# EAGLE design breakout_pmg001 (EAGLE 9.6.2)
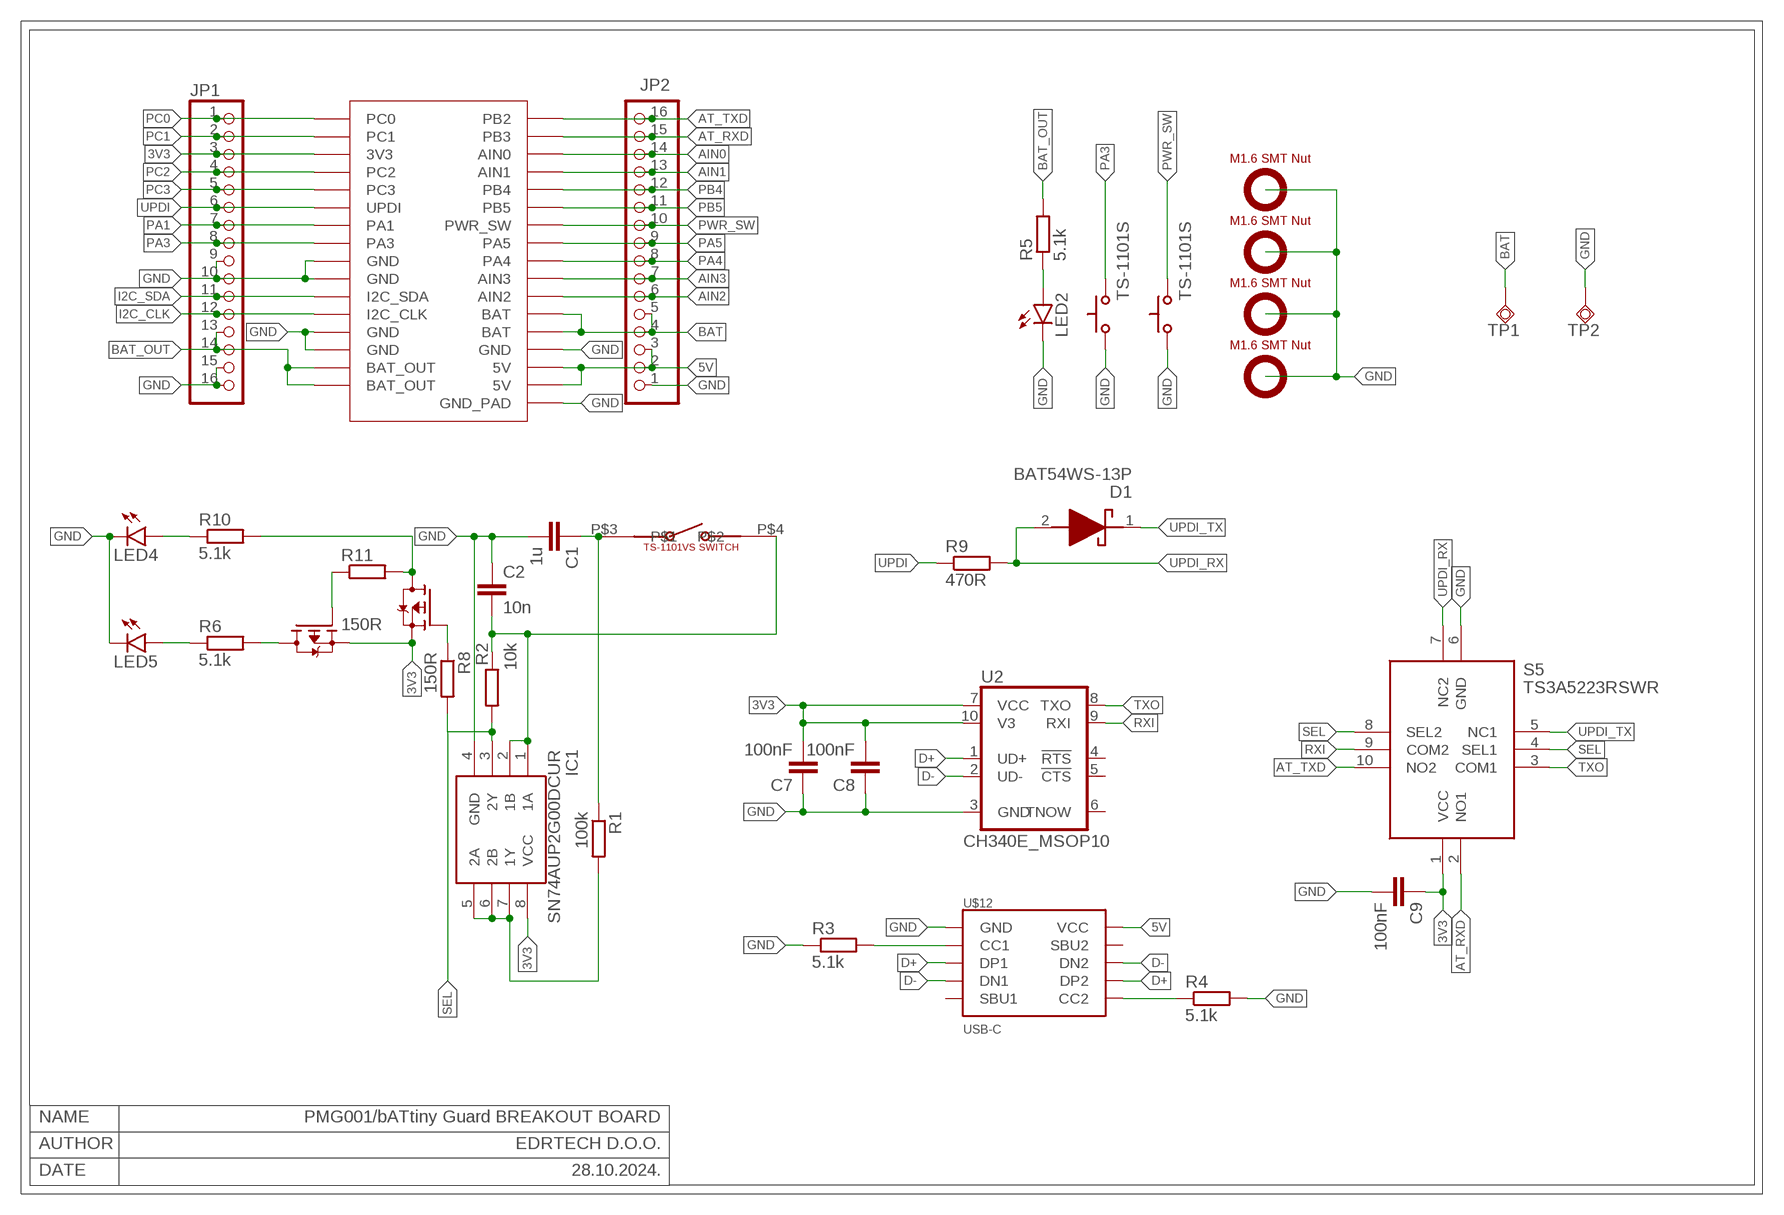
[diagram p0: schematic, sheet 1]

## Parts
C1  1u  C-EUC0402  [C0402]
C2  10n  C-EUC0402  [C0402]
C7  100nF  C-EUC0402  [C0402]
C8  100nF  C-EUC0402  [C0402]
C9  100nF  C-EUC0402  [C0402]
D1  BAT54WS-13P  [SOD2512X115N]
IC1  SN74AUP2G00DCUR  [SOP50P310X90-8N]
JP1  PINHD-1X16  [1X16]
JP2  PINHD-1X16  [1X16]
LED2  LEDCHIP-LED0603  [CHIP-LED0603]
LED4  LEDCHIP-LED0603  [CHIP-LED0603]
LED5  LEDCHIP-LED0603  [CHIP-LED0603]
Q1  NTK3139PT1G  [SOTFL40P120X55-3N]
Q2  NTK3139PT1G  [SOTFL40P120X55-3N]
R1  100k  R-EU_R0402  [R0402]
R2  10k  R-EU_R0402  [R0402]
R3  5.1k  R-EU_R0402  [R0402]
R4  5.1k  R-EU_R0402  [R0402]
R5  5.1k  R-EU_R0402  [R0402]
R6  5.1k  R-EU_R0402  [R0402]
R8  150R  R-EU_R0402  [R0402]
R9  470R  R-EU_R0402  [R0402]
R10  5.1k  R-EU_R0402  [R0402]
R11  150R  R-EU_R0402  [R0402]
S5  TS3A5223RSWR  [RSW(RPUQFNN10)]
TP1  TPSQTP19SQ  [TP19SQ]
TP2  TPSQTP19SQ  [TP19SQ]
U2  CH340E_MSOP10  [MSOP10]
U$1  TS-1101S  [TS-1101S]
U$2  TS-1101VS-C-A-A  [TS-1101VS-C-A-A]
U$4  TS-1101S  [TS-1101S]
U$7  PMG001  [PMG001]
U$8  SMTSO16  [SMTSO16]
U$9  SMTSO16  [SMTSO16]
U$10  SMTSO16  [SMTSO16]
U$11  SMTSO16  [SMTSO16]
U$12  USB-C  [USB-C]

## Nets
3V3: C7.2 C8.2 C9.1 IC1.8(VCC) JP1.3 Q1.2(S) Q2.2(S) S5.1(VCC) U2.7(VCC) U2.10(V3) U$7.P$3(3V3)
5V: JP2.2 JP2.3 U$7.P$17(5V) U$7.P$18(5V) U$12.VCC@1(VCC) U$12.VCC@2(VCC)
AIN0: JP2.14 U$7.P$30(AIN0)
AIN1: JP2.13 U$7.P$29(AIN1)
AIN2: JP2.6 U$7.P$22(AIN2)
AIN3: JP2.7 U$7.P$23(AIN3)
AT_RXD: JP2.15 S5.2(NO1) U$7.P$31(PB3)
AT_TXD: JP2.16 S5.10(NO2) U$7.P$32(PB2)
BAT: JP2.4 JP2.5 TP1.TP U$7.P$20(BAT) U$7.P$21(BAT)
BAT_OUT: JP1.13 JP1.14 R5.2 U$7.P$15(BAT_OUT) U$7.P$16(BAT_OUT)
D+: U2.1(UD+) U$12.DP1 U$12.DP2
D-: U2.2(UD-) U$12.DN1 U$12.DN2
GND: C1.2 C2.1 C7.1 C8.1 C9.2 IC1.4(GND) JP1.9 JP1.10 JP1.15 JP1.16 JP2.1 LED2.C LED4.C LED5.C R3.1 R4.2 S5.6(GND) TP2.TP U2.3(GND) U$1.P$1 U$4.P$1 U$7.P$9(GND) U$7.P$10(GND) U$7.P$13(GND) U$7.P$14(GND) U$7.P$19(GND) U$7.P$33(GND_PAD) U$8.P$1 U$9.P$1 U$10.P$1 U$11.P$1 U$12.GND@1(GND) U$12.GND@2(GND) U$12.P$1(GND) U$12.P$2(GND) U$12.P$3(GND) U$12.P$4(GND)
I2C_CLK: JP1.12 U$7.P$12(I2C_CLK)
I2C_SDA: JP1.11 U$7.P$11(I2C_SDA)
N$1: C2.2 IC1.1(1A) IC1.2(1B) R2.1 U$2.P$4
N$2: R3.2 U$12.CC1
N$3: LED2.A R5.1
N$4: LED5.A R6.1
N$5: Q1.1(G) R8.1
N$6: R4.1 U$12.CC2
N$7: IC1.5(2A) IC1.6(2B) IC1.7(1Y) R1.2
N$8: Q1.3(D) R10.2 R11.2
N$9: Q2.3(D) R6.2
N$10: LED4.A R10.1
N$11: C1.1 R1.1 U$2.P$3
N$12: Q2.1(G) R11.1
PA1: JP1.7 U$7.P$7(PA1)
PA3: JP1.8 U$1.P$2 U$7.P$8(PA3)
PA4: JP2.8 U$7.P$24(PA4)
PA5: JP2.9 U$7.P$25(PA5)
PB4: JP2.12 U$7.P$28(PB4)
PB5: JP2.11 U$7.P$27(PB5)
PC0: JP1.1 U$7.P$1(PC0)
PC1: JP1.2 U$7.P$2(PC1)
PC2: JP1.4 U$7.P$4(PC2)
PC3: JP1.5 U$7.P$5(PC3)
PWR_SW: JP2.10 U$4.P$2 U$7.P$26(PWR_SW)
RXI: S5.9(COM2) U2.9(RXI)
SEL: IC1.3(2Y) R2.2 R8.2 S5.4(SEL1) S5.8(SEL2)
TXO: S5.3(COM1) U2.8(TXO)
UPDI: JP1.6 R9.1 U$7.P$6(UPDI)
UPDI_RX: D1.2(A) R9.2 S5.7(NC2)
UPDI_TX: D1.1(K) S5.5(NC1)
Unconnected: U2.4(!RTS) U2.5(!CTS) U2.6(TNOW) U$12.SBU1 U$12.SBU2

## Notes on the sheet
- NAME | PMG001/bATtiny Guard BREAKOUT BOARD
- AUTHOR | EDRTECH D.O.O.
- DATE | 28.10.2024.

## Library data of the parts
C1 C2 C7-C9 = rcl:C-EU: CAPACITOR, European symbol; SPICEPREFIX: C
D1 = BAT54WS-13P:BAT54WS-13P: Diode 30 V 200mA Surface Mount SOD-323 Source: Datasheet <https://www.mccsemi.com/pdf/Products/BAT54WS(SOD-323).pdf>; DESCRIPTION: Diode 30 V 200mA Surface Mount SOD-323; HEIGHT: 1.15mm; MANUFACTURER_NAME: MCC; MANUFACTURER_PART_NUMBER: BAT54WS-13P
IC1 = SN74AUP2G00DCUR:SN74AUP2G00DCUR: LOW-POWER DUAL 2-INPUT POSITIVE-NAND GATE Source: Datasheet <http://www.ti.com/lit/gpn/sn74aup2g00>; ARROW_PART_NUMBER: SN74AUP2G00DCUR; ARROW_PRICE-STOCK: https://www.arrow.com/en/products/sn74aup2g00dcur/texas-instruments?region=nac; DESCRIPTION: LOW-POWER DUAL 2-INPUT POSITIVE-NAND GATE; HEIGHT: 0.9mm; MANUFACTURER_NAME: Texas Instruments; MANUFACTURER_PART_NUMBER: SN74AUP2G00DCUR; MOUSER_PART_NUMBER: 595-SN74AUP2G00DCUR; MOUSER_PRICE-STOCK: https://www.mouser.co.uk/ProductDetail/Texas-Instruments/SN74AUP2G00DCUR?qs=%2Fqzd9s%252BcLd4Cllum%2F%252Bgttg%3D%3D
JP1 JP2 = edrtech_lib:PINHD-1X16: PIN HEADER
LED2 LED4 LED5 = led:LED: LED OSRAM: - CHIPLED LG R971, LG N971, LY N971, LG Q971, LY Q971, LO R971, LY R971 LH N974, LH R974 LS Q976, LO Q976, LY Q976 LO Q996 - Hyper CHIPLED LW Q18S LB Q993, LB Q99A, LB R99A - SideLED LS A670, LO A670, LY A670, LG A670, LP A670 LB A673, LV A673, LT A673, LW A673 LH A674 LY A675 LS A676, LA A676, LO A676, LY A676, LW A676 LS A679, LY A679, LG A679 - Hyper Micro SIDELED® LS Y876, LA Y876, LO Y876, LY Y876 LT Y87S - SmartLED LW L88C, LW L88S LB L89C, LB L89S, LG L890 LS L89K, LO L89K, LY L89K LS L896, LA L896, LO L896, LY L896 - TOPLED LS T670, LO T670, LY T670, LG T670, LP T670 LSG T670, LSP T670, LSY T670, LOP T670, LYG T670 LG T671, LOG T671, LSG T671 LB T673, LV T673, LT T673, LW T673 LH T674 LS T676, LA T676, LO T676, LY T676, LB T676, LH T676, LSB T676, LW T676 LB T67C, LV T67C, LT T67C, LS T67K, LO T67K, LY T67K, LW E67C LS E67B, LA E67B, LO E67B, LY E67B, LB E67C, LV E67C, LT E67C LW T67C LS T679, LY T679, LG T679 LS T770, LO T770, LY T770, LG T770, LP T770 LB T773, LV T773, LT T773, LW T773 LH T774 LS E675, LA E675, LY E675, LS T675 LS T776, LA T776, LO T776, LY T776, LB T776 LHGB T686 LT T68C, LB T68C - Hyper Mini TOPLED® LB M676 - Mini TOPLED Santana® LG M470 LS M47K, LO M47K, LY M47K Source: http://www.osram.convergy.de LUXEON: - LUMILED® LXK2-PW12-R00, LXK2-PW12-S00, LXK2-PW14-U00, LXK2-PW14-V00 LXK2-PM12-R00, LXK2-PM12-S00, LXK2-PM14-U00 LXK2-PE12-Q00, LXK2-PE12-R00, LXK2-PE12-S00, LXK2-PE14-T00, LXK2-PE14-U00 LXK2-PB12-K00, LXK2-PB12-L00, LXK2-PB12-M00, LXK2-PB14-N00, LXK2-PB14-P00, LXK2-PB14-Q00 LXK2-PR12-L00, LXK2-PR12-M00, LXK2-PR14-Q00, LXK2-PR14-R00 LXK2-PD12-Q00, LXK2-PD12-R00, LXK2-PD12-S00 LXK2-PH12-R00, LXK2-PH12-S00 LXK2-PL12-P00, LXK2-PL12-Q00, LXK2-PL12-R00 Source: www.luxeon.com KINGBRIGHT: KA-3528ASYC Source: www.kingbright.com
Q1 Q2 = edrtech_lib:NTK3139PT1G: ON Semiconductor NTK3139PT1G P-channel MOSFET Transistor, 0.87 A, -20 V, 3-Pin SOT-723 Source: Datasheet <http://www.onsemi.com/pub_link/Collateral/NTK3139P-D.PDF>; ARROW_PART_NUMBER: NTK3139PT1G; ARROW_PRICE-STOCK: https://www.arrow.com/en/products/ntk3139pt1g/on-semiconductor; DESCRIPTION: ON Semiconductor NTK3139PT1G P-channel MOSFET Transistor, 0.87 A, -20 V, 3-Pin SOT-723; HEIGHT: 0.55mm; MANUFACTURER_NAME: onsemi; MANUFACTURER_PART_NUMBER: NTK3139PT1G; MOUSER_PART_NUMBER: 863-NTK3139PT1G; MOUSER_PRICE-STOCK: https://www.mouser.co.uk/ProductDetail/onsemi/NTK3139PT1G?qs=g97OBWmz8%2FUOleSHsosIkQ%3D%3D
R1-R6 R8-R11 = rcl:R-EU_: RESISTOR, European symbol; SPICEPREFIX: R
S5 = TS3A5223RSWR:TS3A5223RSWR: 0.5 Dual SPDT Bidirectional Analog Switch Source: Datasheet <http://www.ti.com/lit/gpn/ts3a5223>; ARROW_PART_NUMBER: TS3A5223RSWR; ARROW_PRICE-STOCK: https://www.arrow.com/en/products/ts3a5223rswr/texas-instruments?region=nac; DESCRIPTION: 0.5 Dual SPDT Bidirectional Analog Switch; HEIGHT: mm; MANUFACTURER_NAME: Texas Instruments; MANUFACTURER_PART_NUMBER: TS3A5223RSWR; MOUSER_PART_NUMBER: 595-TS3A5223RSWR; MOUSER_PRICE-STOCK: https://www.mouser.co.uk/ProductDetail/Texas-Instruments/TS3A5223RSWR?qs=nEyf2%252Bd9RBmZJQRiNjZi8g%3D%3D
TP1 TP2 = testpad:TPSQ: Test pad
U2 = CH340E:CH340E: Check availability <https://pricing.snapeda.com/parts/CH340E/WCH/view-part?ref=eda>; AVAILABILITY: Not in stock; CHECK_PRICES: https://www.snapeda.com/parts/CH340E/WCH/view-part/?ref=eda; DESCRIPTION: USB to serial chip CH340; MF: WCH; MP: CH340E; PACKAGE: Package; PRICE: None; SNAPEDA_LINK: https://www.snapeda.com/parts/CH340E/WCH/view-part/?ref=snap
U$1 U$4 = edrtech_lib:TS-1101S
U$2 = circuitmess_device_library:TS-1101VS-C-A-A
U$7 = edrtech_lib:PMG001
U$8-U$11 = edrtech_lib:SMTSO16
U$12 = edrtech_lib:USB-C

## Board
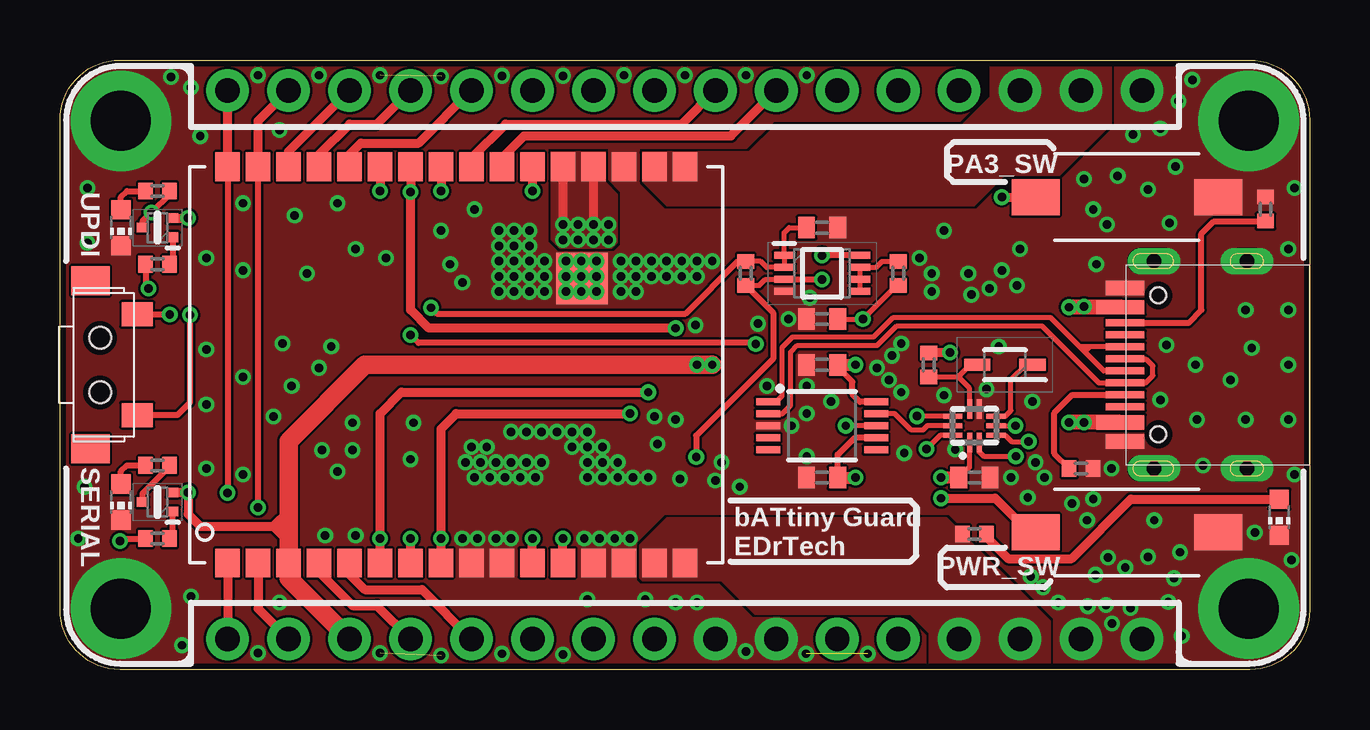
[diagram p1: board, top side]
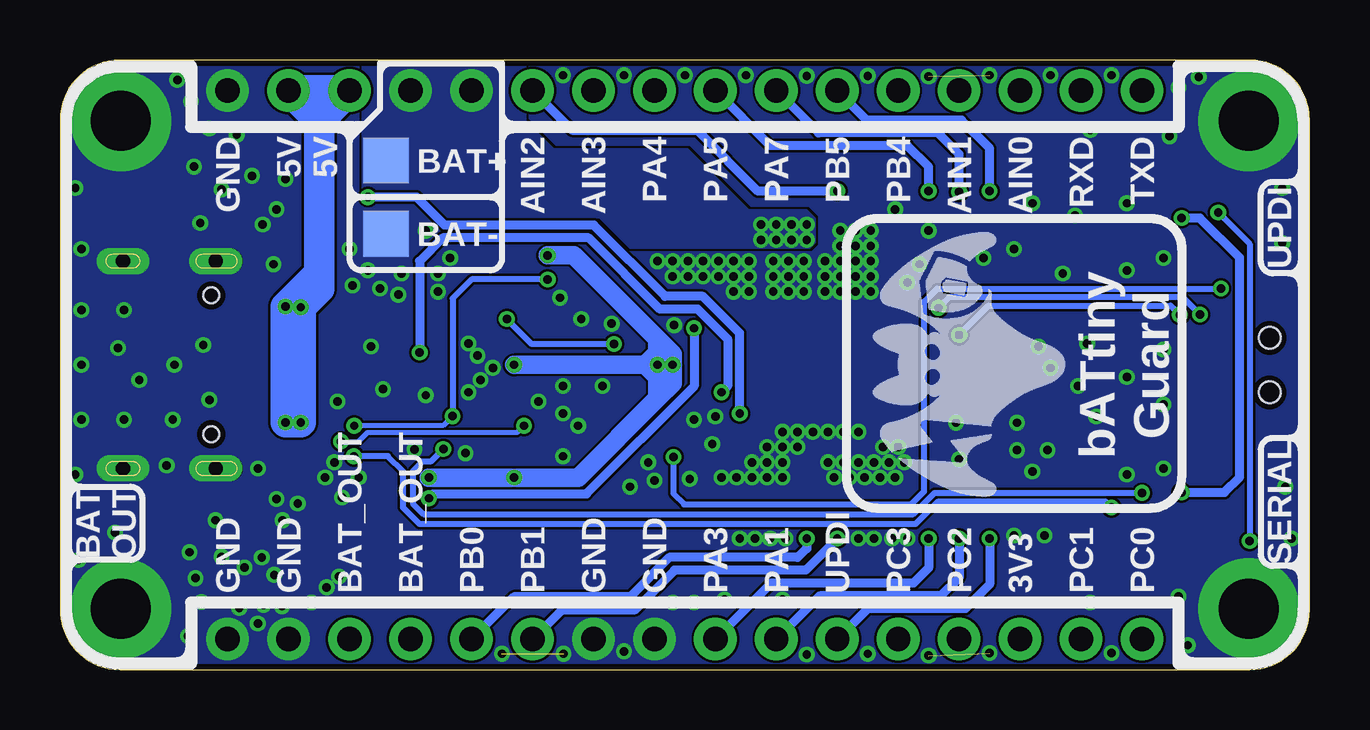
[diagram p2: board, bottom side, seen from below]

Size 52.07 x 25.4 mm. Coordinates in mm from the lower left corner, seen from the top.
Outline: 52.07,22.9 52.07,2.5 arc-90 49.57,0 2.5,0 arc-90 0,2.5 0,22.9 arc-90 2.5,25.4 49.57,25.4 arc-90 52.07,22.9
Copper layers (1*16): Top 0.035mm / dielectric 1.5mm / Bottom 0.035mm
Design rules "dirt_cheap_dirty_boards.v1.1 *": minimum track width 6mil, minimum drill 12mil, track to track 4mil, track to pad 6mil, pad to pad 6mil, via to via 6mil, smd to smd 0mil, copper to edge 10mil, drill to drill 10mil, minimum pad ring 10mil, minimum via ring 6mil, stop-mask expansion 2mil, vias tented up to drill 25mil, thermal gap 10mil

### Footprints (pad centres in the part's own frame; a part is rotated, then mirrored left to right if it is on the bottom)
C0402 = smd 0.7 x 0.9: 1 -0.65,0; 2 0.65,0
SOD2512X115N = smd 1.1 x 0.5: 1 -1.15,0; 2 1.15,0
SOP50P310X90-8N = smd 0.85 x 0.3: 1 -1.575,0.75; 2 -1.575,0.25; 3 -1.575,-0.25; 4 -1.575,-0.75; 5 1.575,-0.75; 6 1.575,-0.25; 7 1.575,0.25; 8 1.575,0.75
1X16 = drill 1.016 pad 1.778: 1 -19.05,0; 2 -16.51,0; 3 -13.97,0; 4 -11.43,0; 5 -8.89,0; 6 -6.35,0; 7 -3.81,0; 8 -1.27,0; 9 1.27,0; 10 3.81,0; 11 6.35,0; 12 8.89,0; 13 11.43,0; 14 13.97,0; 15 16.51,0; 16 19.05,0
CHIP-LED0603 = smd 0.8 x 0.8: A 0,-0.75; C 0,0.75
SOTFL40P120X55-3N = smd 0.465 x 0.4: 1 -0.632,0.4; 2 -0.632,-0.4; 3 0.632,0
R0402 = smd 0.6 x 0.7: 1 -0.5,0; 2 0.5,0
RSW(RPUQFNN10) = smd 0.2 x 0.8: 1 -0.2,-0.7; 2 0.2,-0.7; 6 0.2,0.7; 7 -0.2,0.7 | smd 0.8 x 0.2: 3 0.9,-0.4; 4 0.9,0; 5 0.9,0.4; 8 -0.9,0.4; 9 -0.9,0; 10 -0.9,-0.4
TP19SQ = smd 1.9 x 1.9: TP 0,0
MSOP10 = smd 1 x 0.3: 1 -2.25,1; 2 -2.25,0.5; 3 -2.25,0; 4 -2.25,-0.5; 5 -2.25,-1; 6 2.25,-1; 7 2.25,-0.5; 8 2.25,0; 9 2.25,0.5; 10 2.25,1
TS-1101S = smd 2 x 1.5: P$1 -3.8,0; P$2 3.8,0
TS-1101VS-C-A-A = smd 1.2 x 1.6: GND -3.5,0; GND@1 3.5,0 | smd 1 x 1.3: P$3 -2.1,-1.95; P$4 2.1,-1.95 | hole 0.9: -1.15,-0.4; 1.12,-0.4
PMG001 = smd 1.194 x 1.016: P$1 -8.255,9.525; P$2 -8.255,8.255; P$3 -8.255,6.985; P$4 -8.255,5.715; P$5 -8.255,4.445; P$6 -8.255,3.175; P$7 -8.255,1.905; P$8 -8.255,0.635; P$9 -8.255,-0.635; P$10 -8.255,-1.905; P$11 -8.255,-3.175; P$12 -8.255,-4.445; P$13 -8.255,-5.715; P$14 -8.255,-6.985; P$15 -8.255,-8.255; P$16 -8.255,-9.525; P$17 8.255,-9.525; P$18 8.255,-8.255; P$19 8.255,-6.985; P$20 8.255,-5.715; P$21 8.255,-4.445; P$22 8.255,-3.175; P$23 8.255,-1.905; P$24 8.255,-0.635; P$25 8.255,0.635; P$26 8.255,1.905; P$27 8.255,3.175; P$28 8.255,4.445; P$29 8.255,5.715; P$30 8.255,6.985; P$31 8.255,8.255; P$32 8.255,9.525 | smd 2.15 x 2.15: P$33 3.6,-5.24
SMTSO16 = drill 2.5 pad 4.19: P$1 0,0
USB-C = smd 0.3 x 1.6: CC1 -1.25,3.88; CC2 1.75,3.88; DN1 0.25,3.88; DN2 -0.75,3.88; DP1 -0.25,3.88; DP2 0.75,3.88; SBU1 1.25,3.88; SBU2 -1.75,3.88 | smd 0.6 x 1.6: GND@1 -3.2,3.88; GND@2 3.2,3.88 | drill 0.6 pad 1 long: P$1 -4.32,-1.19; P$2 4.32,-1.19; P$3 4.32,2.68; P$4 -4.32,2.68 | smd 0.6 x 2: VCC@1 -2.4,4.08; VCC@2 2.4,4.08 | hole 0.65: 2.89,2.49; -2.89,2.49

### Placement (x,y rotation side)
C1  31.75,14.61 180 top
C2  31.75,18.41 180 top
C7  31.75,12.7 0 top
C8  31.75,8 0 top
C9  38.1,8 0 top
D1  39.37,12.7 180 top
IC1  31.75,16.51 0 top
JP1  26.04,1.27 0 top
JP2  26.04,24.13 180 top
LED2  50.8,6.35 180 top
LED4  2.54,18.41 180 top
LED5  2.54,6.99 180 top
Q1  4.06,18.41 180 top
Q2  4.06,6.99 180 top
R1  34.92,16.51 90 top
R2  28.57,16.51 270 top
R3  42.55,8.38 180 top
R4  50.23,19.18 90 top
R5  38.1,5.65 180 top
R6  4.06,8.51 0 top
R8  4.06,16.89 180 top
R9  36.2,12.7 270 top
R10  4.06,19.94 0 top
R11  4.06,5.46 180 top
S5  38.1,10.16 0 top
TP1  38.48,21.21 0 bottom
TP2  38.48,18.16 0 bottom
U2  31.75,10.16 0 top
U$1  44.45,19.68 180 top
U$2  1.27,12.7 90 top
U$4  44.45,5.71 180 top
U$7  16.51,12.7 90 top
U$8  49.53,2.54 90 top
U$9  49.53,22.86 90 top
U$10  2.54,2.54 90 top
U$11  2.54,22.86 90 top
U$12  48.26,12.7 90 top

### Tracks (layer width: path | path; a pad name or v marks a point on that pad's centre or on a via)
3V3  (via drill 0.35)
  Top 0.203: C9.1 37.9,8.45 S5.1
  Top 0.254: U2.7 33.1,9.66 32.4,8.96 C8.2 | 32.4,12.56 C7.2 32.4,12.61 33.02,11.99 33.02,11.48 33.34,11.16 U2.10 | IC1.8 v31.75,17.26
  Top 0.381: Q1.2 v5.33,18.82 | Q2.2 v5.33,7.38 5.33,6.48 5.84,5.97 8.89,5.97 | 9.53,5.97 8.89,5.97 | 8.89,5.97 9.53,6.6 | 8.89,5.97 9.53,5.33
  Top 0.508: C9.1 v36.7,8 | C8.2 v33.15,8 | C7.2 v33.15,12.7
  Top 0.762: v27.18,12.7 12.7,12.7 9.53,9.53 9.53,6.6 9.53,5.97 9.53,5.33 U$7.P$3 9.53,3.81 JP1.3
  Bottom 0.381: v5.33,7.38 3.56,7.38 2.92,8.02 2.92,17.16 4.57,18.82 v5.33,18.82
  Bottom 0.762: v27.18,12.7 27.69,12.7 | 27.69,12.7 v33.15,12.7 | v27.18,12.7 27.18,13.78 | v31.75,17.26 30.66,17.26 27.18,13.78 | v27.18,12.7 27.18,12.19 | 27.18,12.19 27.18,12.06 | 27.18,11.3 30.48,8 v33.15,8 v36.7,8 | v26.54,12.7 26.54,13.14 27.18,13.78 | v26.54,12.7 27.18,12.06 | 27.18,12.06 27.18,11.3 | 27.69,12.7 27.05,13.34 26.92,13.34 | 27.69,12.7 | 27.69,12.7 27.18,12.19 | v26.54,12.7 26.54,11.94 27.18,11.3
5V  (via drill 0.35)
  Top 0.635: U$12.VCC@1 v42.04,10.3 | U$12.VCC@2 v42.04,15.1
  Bottom 1.27: v42.04,15.1 v42.04,10.3 v42.67,10.3 v42.67,15.13 | 41.27,16.52 41.27,15.86 v42.04,15.1 | 41.27,22.86 41.27,16.64 41.27,16.52 | 41.27,22.86 JP2.3 JP2.2 41.27,22.86 | v42.04,15.1 42.06,15.13 v42.67,15.13 | v42.67,15.13 41.27,16.52
  pour Top (no thermals): 24.26,21.59 28.7,21.59 29.84,22.73 37.59,22.73 38.73,23.88 38.73,25.4 43.81,25.4 43.81,22.73 41.66,20.57 39.37,20.57 38.1,19.3 25.27,19.3 24.26,20.32
AIN0
  Top 0.381: U$7.P$30 9.53,21.59 JP2.14
AIN1
  Top 0.381: U$7.P$29 10.79,21.46 12.06,22.73 13.21,22.73 JP2.13
AIN2  (via drill 0.35)
  Top 0.381: U$7.P$22 v19.68,19.94
  Bottom 0.381: JP2.6 30.73,22.48 25.53,22.48 22.99,19.94 v19.68,19.94
AIN3
  Top 0.381: U$7.P$23 18.41,21.31 19.34,22.24 27.95,22.24 JP2.7
AT_RXD  (via drill 0.35)
  Top 0.203: S5.2 38.3,9.07 38.48,8.89 v39.83,8.89
  Top 0.254: v8.26,6.76 U$7.P$31
  Top 0.381: U$7.P$31 8.26,22.86 JP2.15
  Bottom 0.254: v39.83,8.89 38.41,8.89 37.77,8.26 37.77,6.75 37.09,6.07 16.42,6.07 15.48,7.01 8.51,7.01 v8.26,6.76
AT_TXD  (via drill 0.35)
  Top 0.203: S5.10 36.67,9.76 v36.1,9.19
  Top 0.254: U$7.P$32 v6.99,7.37
  Top 0.381: U$7.P$32 JP2.16
  Bottom 0.254: v36.1,9.19 36.63,8.66 36.98,8.66 37.36,8.28 37.36,6.91 36.93,6.48 16.52,6.48 15.62,7.37 v6.99,7.37
BAT  (via drill 0.35)
  Top 0.381: U$7.P$21 v20.95,18.54 | U$7.P$20 v22.23,18.54
  other vias: 20.95,17.91 22.23,17.91 21.59,17.91 21.59,18.54 22.86,18.54 22.86,17.91
  pour Bottom (no thermals): 20.95,19.18 20.57,18.8 20.57,17.78 20.83,17.53 28.32,17.53 29.59,18.8 35.94,18.8 37.08,19.94 39.5,19.94 39.5,25.4 32.64,25.4 32.64,22.86 31.5,21.72 25.91,21.72 23.37,19.18
  pour Top (no thermals): 20.45,21.59 20.45,17.91 20.83,17.53 22.99,17.53 23.24,17.78 23.24,19.81 22.73,20.32 22.73,21.59
BAT_OUT
  pour Top (no thermals): 24.13,5.21 25.27,6.35 36.96,6.35 41.27,2.03 41.27,0 36.2,0 36.2,1.52 35.43,2.29 28.96,2.29 27.56,3.68 24.26,3.68 24.13,3.81
D+
  Top 0.203: U$12.DP2 42.93,13.45 42.91,13.45 | U$12.DP1 43.48,12.45 42.7,13.23 | 42.7,13.23 42.51,13.43 | 42.51,13.43 41.25,14.68 34.72,14.68 33.9,13.86 30.52,13.86 30.09,13.43 30.09,11.4 29.84,11.16 U2.1 | 42.91,13.45 42.53,13.45 42.51,13.43 | 42.7,13.23 42.91,13.45
D-
  Top 0.203: U$12.DN1 45.24,12.95 45.53,12.65 45.53,12.24 45.24,11.95 U$12.DN2 43.28,11.95 40.91,14.33 34.87,14.33 34.05,13.51 30.72,13.51 30.45,13.23 30.45,11.01 30.09,10.66 U2.2
GND  (via drill 0.35)  (3 unrouted)
  other vias: 16.76,5.46 18.8,5.46 18.16,5.46 17.4,5.46 18.8,9.91 17.27,8 17.91,8 18.54,8 19.18,8 19.81,8 16.89,8.64 17.53,8.64 18.16,8.64 18.8,8.64 19.43,8.64 20.07,8.64 17.14,9.27 17.78,9.27 21.08,17.02 21.72,17.02 22.35,17.02 21.08,16.38 21.72,16.38 22.35,16.38 21.08,15.75 21.72,15.75 22.35,15.75 20.19,17.02 19.56,17.02 18.92,17.02 18.29,17.02 18.29,16.38 18.29,15.75 18.92,15.75 19.56,15.75 20.19,15.75 20.19,16.38 23.37,17.02 24,17.02 24.64,17.02 25.27,17.02 25.91,17.02 26.54,17.02 27.18,17.02 23.37,16.38 24,16.38 24.64,16.38 25.27,16.38 25.91,16.38 26.54,16.38 23.37,15.75 24,15.75 18.92,16.38 19.56,16.38 18.29,17.65 18.92,17.65 19.56,17.65 18.29,18.29 18.92,18.29 19.56,18.29 21.97,8 22.61,8 23.24,8 23.88,8 24.51,8 21.97,8.64 21.97,9.27 21.97,9.91 22.61,9.27 21.34,9.91 20.7,9.91 20.07,9.91 19.43,9.91 22.61,8.64 23.24,8.64 21.34,9.27 24.77,10.54 25.65,10.41 27.56,8.64 27.3,7.87 28.32,7.62 25.83,7.95 24.89,9.4 21.84,5.46 22.48,5.46 23.11,5.46 11.05,5.59 11.56,8.26 12.19,9.14 12.19,10.29 10.79,12.57 9.65,11.81 8.89,10.54 7.62,8.13 6.1,8.38 5.46,3.05 5.08,1.02 0.76,5.46 1.02,7.62 1.14,17.78 1.14,20.07 5.84,22.23 5.46,24.26 9.78,18.92 12.32,17.53 10.29,16.51 6.1,17.14 7.62,19.43 7.62,16.64 7.62,12.19 13.59,17.14 11.3,13.46 11.56,19.43 9.14,22.48 15.88,18.29 16.26,16.89 17.27,19.18 16.76,16.13 9.27,13.59 6.1,13.34 6.1,11.05 26.54,2.79 25.65,2.79 24.38,2.92 42.82,2.64 43.59,2.69 44.6,2.57 46.18,2.82 43.66,4.67 45.34,4.7 42.8,6.22 45.59,6.22 46.74,1.4 23.75,5.46 21.97,2.92 9.14,2.79 12.32,5.59 30.48,10.16 31.11,11.81 31.11,8.89 38.61,11.68 39.62,8 41.02,8 40.64,8.64 43.81,8.38 40.51,11.18 36.83,11.43 34.54,12.06 34.67,13.08 39.12,13.46 38.73,15.88 36.32,16.51 36.83,18.29 39.24,16.64 40.01,17.53 37.85,16.51 48.77,12.06 39.88,16 37.97,15.62 36.32,15.75 35.81,17.14 30.35,14.61 29.08,14.41 31.24,15.49 35.05,13.59 34.04,12.57 35.05,11.56 32.13,11.18 31.11,10.67 29.46,11.81 49.78,5.71 51.31,4.57 51.44,8.13 51.18,17.53 46.23,18.61 46.48,20.95 42.67,20.45 43.18,16.89 43.05,19.18 47.31,12.7 49.4,14.99 49.4,10.41 47.37,10.41 51.18,14.99 51.18,10.41 51.18,12.7 14.73,10.29 14.61,8.76 10.92,9.14 35.18,9.02 37.3,9.18 26.48,14.35 40.32,7.18 41.59,2.79 40.96,3.43 40.45,3.87 43.14,3.95 44.39,4.25 46.42,3.81 46.67,4.89 42.16,6.92 43.05,7.11 43.62,18.54 44.07,20.57 45.34,20 51.44,20.07 44.7,22.29 45.85,22.54 46.61,23.69 47.18,24.57 49.66,13.4 45.85,11.24 47.62,8.51 46.1,13.53 15.88,0.58 18.41,0.66 20.95,0.64 31.09,0.66 33.66,0.66 13.34,24.77 15.88,24.71 18.41,24.74 20.95,24.74 23.5,24.77 26.04,24.77 28.57,24.77 31.11,24.77 10.79,24.77 8.26,24.77 4.62,24.69 8.26,0.69 13.34,0.69 28.57,0.76 43.83,1.92
  pour Top (rank 6, no thermals): 2.5,0 49.57,0 arc90 52.07,2.5 52.07,22.9 arc90 49.57,25.4 2.5,25.4 arc90 0,22.9 0,2.5 arc90
  pour Bottom (rank 6, no thermals): 2.5,0 49.57,0 arc90 52.07,2.5 52.07,22.9 arc90 49.57,25.4 2.5,25.4 arc90 0,22.9 0,2.5 arc90
  pour Top (rank 5, no thermals): 41,5 47,5 47,2 41,2
I2C_CLK  (via drill 0.35)
  Top 0.381: U$7.P$12 v20.95,5.46
  Bottom 0.381: v20.95,5.46 20.95,5.05 21.34,4.67 26.68,4.67 28.32,3.04 33.16,3.04 JP1.12
I2C_SDA  (via drill 0.35)
  Top 0.381: U$7.P$11 v19.68,5.46
  Bottom 0.381: JP1.11 31.15,2.5 28.1,2.5 26.46,4.14 21.01,4.14 v19.68,5.46
N$1  (via drill 0.35)
  Top 0.203: C2.2 30.38,18.41 30.18,18.21 IC1.1 IC1.2 29.44,16.76 29.19,17.01 R2.1
  Top 0.254: v15.46,15.08 15.71,14.83 26.07,14.83 28.25,17.01 R2.1 | U$2.P$4 v4.57,14.8
  Bottom 0.254: v15.46,15.08 15.02,15.52 5.29,15.52 v4.57,14.8
N$2
  Top 0.254: R3.2 41.43,9 41.43,10.7 42.18,11.45 U$12.CC1
N$3
  Top 0.381: R5.1 38.6,5.53 39.51,4.62 42.15,4.62 44.62,7.1 LED2.A
N$4
  Top 0.254: LED5.A 2.54,8.26 2.79,8.51 R6.1
N$5
  Top 0.254: Q1.1 4.7,17.02 R8.1
N$6
  Top 0.254: U$12.CC2 47.03,14.45 47.56,14.99 47.56,18.16 48.06,18.66 50.2,18.66 R4.1
N$7
  Top 0.203: IC1.5 IC1.6 IC1.7 34.01,16.76 34.26,17.01 R1.2
N$8  (via drill 0.35)
  Top 0.254: R10.2 4.56,19.8 v3.81,19.05 3.43,18.67 Q1.3 | v2.5,5.36 2.61,5.46 R11.2
  Bottom 0.254: v3.81,19.05 2.5,17.74 v2.5,5.36
N$9
  Top 0.254: R6.2 4.56,8.46 3.43,7.33 Q2.3
N$10
  Top 0.254: LED4.A 2.54,19.68 2.79,19.94 R10.1
N$11  (via drill 0.35)
  Top 0.203: C1.1 v33.45,14.61 34.86,16.01 R1.1
  Top 0.254: v28.99,13.56 28.94,13.61 14.94,13.61 v14.61,13.94 | v5.41,14.78 5.41,11.13 4.88,10.6 U$2.P$3
  Bottom 0.254: v28.99,13.56 32.41,13.56 v33.45,14.61 | v14.61,13.94 13.38,15.16 5.79,15.16 v5.41,14.78
N$12
  Top 0.254: R11.1 4.7,5.59 Q2.1
PA1  (via drill 0.35)
  Top 0.381: U$7.P$7 v14.61,5.46
  Bottom 0.381: JP1.7 20.42,3.07 15.37,3.07 14.61,3.83 v14.61,5.46
PA3  (via drill 0.35)
  Top 0.381: v39.24,19.68 U$1.P$2 | U$7.P$8 v15.88,5.46 15.88,10.03 16.51,10.67 v23.75,10.67
  Bottom 0.381: v15.88,5.46 15.88,4.24 16.51,3.61 22.43,3.61 JP1.8 | v23.75,10.67 23.75,14.02 25.28,15.55 26.86,15.55 29.82,18.52 36.04,18.52 37.21,19.68 v39.24,19.68
PA4
  Top 0.381: U$7.P$24 17.14,21.3 18.56,22.72 25.9,22.72 JP2.8
PA5  (via drill 0.35)
  Top 0.381: U$7.P$25 v15.88,19.94
  Bottom 0.381: v15.88,19.94 U$7.P$25 16.76,21.83 22.47,21.83 JP2.9
PB4
  Top 0.381: U$7.P$28 12.06,21.46 12.53,21.93 14.95,21.93 JP2.12
PB5  (via drill 0.35)
  Top 0.381: U$7.P$27 v13.34,19.94
  Bottom 0.381: v13.34,19.94 13.34,21.72 14.52,22.9 18.45,22.9 JP2.11
PC0
  Top 0.381: U$7.P$1 JP1.1
PC1
  Top 0.381: U$7.P$2 8.26,2.54 JP1.2
PC2
  Top 0.381: U$7.P$4 10.79,4.06 12.19,2.67 13.21,2.67 JP1.4
PC3
  Top 0.381: U$7.P$5 12.06,3.96 12.7,3.33 15.09,3.33 JP1.5
PWR_SW  (via drill 0.35)
  Top 0.381: U$7.P$26 v14.61,19.9 14.61,14.99 15.37,14.22 v25.65,14.22 | v36.7,7.14 38.96,7.14 40.39,5.71 U$4.P$2
  Bottom 0.381: v14.61,19.9 14.61,21.48 15.49,22.36 20.46,22.36 JP2.10 | v25.65,14.22 25.65,11.81 30.14,7.32 36.52,7.32 v36.7,7.14
RXI
  Top 0.203: S5.9 36.13,10.16 35.95,9.98 35.47,9.98 34.79,10.66 U2.9
SEL  (via drill 0.35)
  Top 0.203: S5.8 v35.71,10.56 | S5.4 v39.81,10.16 | R2.2 29.14,16.01 29.39,16.26 IC1.3
  Top 0.254: IC1.3 v31.75,16.26 | R2.2 29.71,14.88 29.71,12.95 26.51,9.75 v26.51,8.86 | R8.2 3.56,16 v3.69,15.88
  Bottom 0.203: v39.81,10.16 39.79,10.19 36.09,10.19 v35.71,10.56
  Bottom 0.254: v31.75,16.26 34.92,16.26 35.71,15.47 v35.71,10.56 | v26.51,8.86 26.51,7.33 26.06,6.88 16.61,6.88 16.07,7.43 16.07,15.33 15.52,15.88 v3.69,15.88
TXO  (via drill 0.35)
  Top 0.203: S5.3 39.39,9.76 39.65,9.5 v40.36,9.5 | U2.8 v32.74,10.16
  Bottom 0.203: v40.36,9.5 39.63,9.5 39.25,9.88 33.02,9.88 v32.74,10.16
UPDI  (via drill 0.35)
  Top 0.381: U$7.P$6 v13.34,5.46 13.34,10.67 14.22,11.56 v24.51,11.56 | v37.08,13.21 v37.08,13.2 R9.1
  Bottom 0.381: v13.34,5.46 13.34,3.56 14.35,2.54 18.41,2.54 JP1.6 | v24.51,11.56 24.26,11.81 24.26,13.78 25.5,15.02 27.08,15.02 30.04,17.98 36.12,17.98 37.08,17.02 v37.08,13.21
UPDI_RX
  Top 0.203: R9.2 37.42,12.2 | D1.2 37.92,12.7 37.53,12.31 37.51,12.29 | 37.42,12.2 37.51,12.29 | S5.7 37.9,11.72 37.51,12.11 | 37.51,12.11 37.42,12.2 | 37.51,12.11 37.51,12.29
UPDI_TX
  Top 0.203: S5.5 39.39,10.56 39.62,10.79 39.62,12.09 40.23,12.7 D1.1

### Text on the board
tPlace: PA3_SW | UPDI | SERIAL | bATtiny Guard / EDrTech | PWR_SW
bPlace: TXD | RXD | AIN0 | AIN1 | PB4 | PB5 | PA7 | PA5 | PA4 | AIN3 | AIN2 | 5V | 5V | GND | BAT+ | UPDI | BAT- | bATtiny / Guard | SERIAL | BAT / OUT | PC0 | PC1 | 3V3 | PC2 | PC3 | UPDI | PA1 | PA3 | GND | GND | PB1 | PB0 | BAT_OUT | BAT_OUT | GND | GND
tStop: EDrTech